# Altium schematic sheet Sunfish_ECU_Power_RevA.SchDoc
size A3; _PRJ_TITLE: PROJECT TITLE; _SHT_TITLE: Sheet; _REV: A; PageSetup: Record=PageOptions|CenterHorizontal=True|CenterVertical=True|PrintScale=0.71|XCorrection=1.00|YCorrection=1.00|PrintKind=0|BorderSize=5000000|LeftOffset=0|BottomOffset=0|Orientation=2|PaperLength=1000|PaperWidth=1000|Scale=100|PaperSource=258|PrintQuality=600|MediaType=1|DitherType=10|PaperKind=A3 (297x420mm)|PrintScaleMode=1
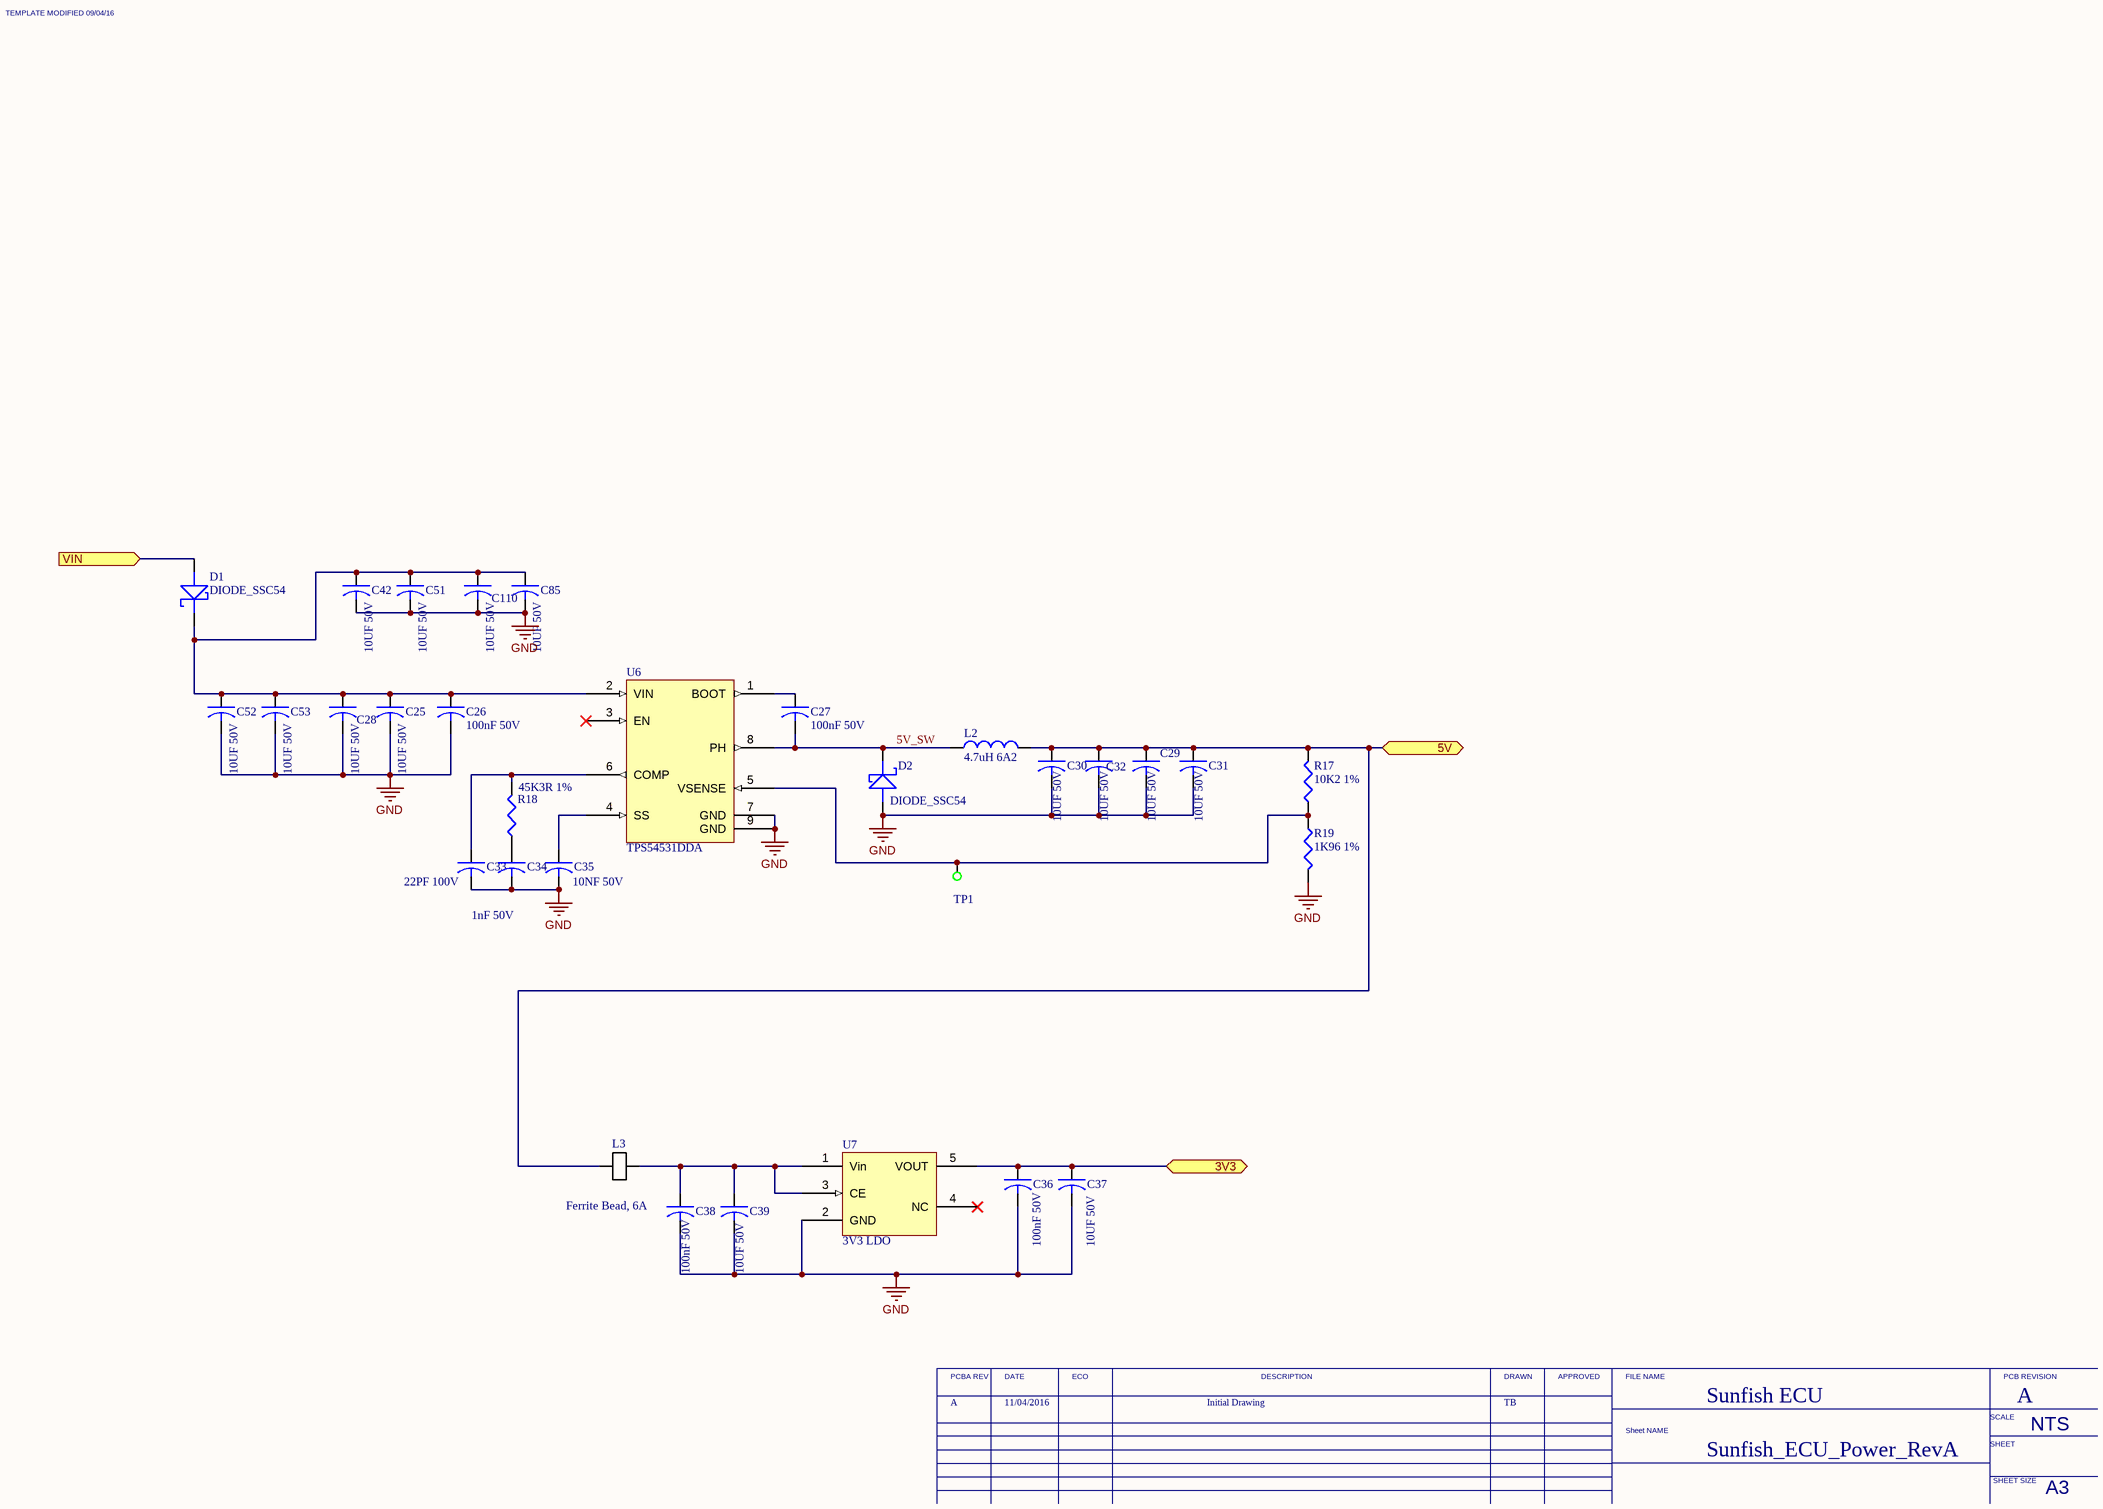
[diagram p0: Sunfish_ECU_Power_RevA.SchDoc]

## Parts
C25  10UF 50V  [1206]
C26  100nF 50V  [0603]
C27  100nF 50V  [0603]
C28  10UF 50V  [1206]
C29  10UF 50V  [1206]
C30  10UF 50V  [1206]
C31  10UF 50V  [1206]
C32  10UF 50V  [1206]
C33  22PF 100V  [0603]
C34  1nF 50V  [0603]
C35  10NF 50V  [0603]
C36  100nF 50V  [0603]
C37  10UF 50V  [1206]
C38  100nF 50V  [0603]
C39  10UF 50V  [1206]
C42  10UF 50V  [1206]
C51  10UF 50V  [1206]
C52  10UF 50V  [1206]
C53  10UF 50V  [1206]
C85  10UF 50V  [1206]
C110  10UF 50V  [1206]
D1  DIODE_SSC54  [DO-214AB]
D2  DIODE_SSC54  [DO-214AB]
L2  4.7uH 6A2  [Wurth744771156]
L3  Ferrite Bead, 6A  [1806]
R17  10K2 1%  [0603]
R18  45K3R 1%  [0603]
R19  1K96 1%  [0603]
TP1  Test Point  [TP_SMT]  (value not drawn)
U6  TPS54531DDA  [PSOP-8]
U7  3V3 LDO  [SOT-25-A]

## Ports
3V3 (bidir), 5V (bidir), VIN (in)

## Nets
GND: C25.2 C26.2 C28.2 C29.2 C30.2 C31.2 C32.2 C33.2 C34.2 C35.2 C36.2 C37.2 C38.2 C39.2 C42.2 C51.2 C52.2 C53.2 C85.2 C110.2 D2.A R19.2 U6.7(GND) U6.9(GND) U7.2(GND)
3V3: C36.1 C37.1 U7.5(VOUT) ; port 3V3
5V: C29.1 C30.1 C31.1 C32.1 L2.2 L3.1 R17.2 ; port 5V
5V_SW: C27.2 D2.K L2.1 U6.8(PH)
VIN: D1.A ; port VIN
NetC25_1: C25.1 C26.1 C28.1 C42.1 C51.1 C52.1 C53.1 C85.1 C110.1 D1.K U6.2(VIN)
NetC27_1: C27.1 U6.1(BOOT)
NetC33_1: C33.1 R18.2 U6.6(COMP)
NetC34_1: C34.1 R18.1
NetC35_1: C35.1 U6.4(SS)
NetC38_1: C38.1 C39.1 L3.2 U7.1(Vin) U7.3(CE)
NetR17_1: R17.1 R19.1 TP1.1 U6.5(VSENSE)

Not connected (* = marked no-connect by the designer): U6 3(EN)*; U7 4(NC)*

## Notes on the sheet
- A
- 11/04/2016
- Initial Drawing
- TB
- Sunfish ECU
- Sunfish_ECU_Power_RevA
- TEMPLATE MODIFIED 09/04/16
- PCBA REV
- DATE
- ECO
- DESCRIPTION
- DRAWN
- APPROVED
- FILE NAME
- PCB REVISION
- Sheet NAME
- SCALE
- SHEET
- NTS
- SHEET SIZE
- A3

## Library data of the parts
C25 C28-C32 C37 C39 C42 C51-C53 C85 C110 = CAP_10UF_50V_10%_1206: CAP CER 10UF 50V 10% X5R 1206; Manufacturer: Murata; Manufacturer P/N: GRM31CR61H106KA12L
C26 C27 C36 C38 = CAP_100NF_50V_10%_0603: CAP CER 100nF 50V 10% X7R 0603; Manufacturer: Murata; Manufacturer P/N: GRM188R71H104KA93D
C33 = CAP_22PF_100V_5%_0603: CAP CER 22PF 100V 5% NP0 0603; Manufacturer: Murata; Manufacturer P/N: GRM1885C2A220JA01D
C34 = CAP_1NF_50V_10%_0603: CAP CER 1nF 50V 10% X7R 0603; Manufacturer: Murata; Manufacturer P/N: GRM188R71H102KA01D
C35 = CAP_10NF_50V_10%_0603: CAP CER 10NF 50V 10% X7R 0603; Manufacturer: Murata; Manufacturer P/N: GRM188R71H103KA01D
D1 D2 = DIODE_SSC54: Schottky Diode, 5A, 40V SSC54, DO214AB; Manufacturer: Vishay; Manufacturer P/N: SSC54-E3/9AT
L2 = IND_4.7uH_6A2: FIXED IND 4.7UH 6.2A 34 MOHM; Manufacturer: Wurth Electronics Inc; Manufacturer P/N: 74437356047
L3 = IND_FERRITE_ BLM41PG600SN1L: Manufacturer: MURATA; Manufacturer P/N: BLM41PG600SN1L
R17 = RES_10K2_1%_0603: Resistor, 10K2, 1%, 0603; Manufacturer: Yageo; Manufacturer P/N: RC0603FR-0710K2L
R18 = RES_45K3_1%_0603: Resistor, 45K3, 1%, 0603; Manufacturer: Bourns Inc; Manufacturer P/N: CR0603-FX-4532ELF
R19 = RES_1K96_1%_0603: Resistor, 1K96, 1%, 0603; Manufacturer: Yageo; Manufacturer P/N: RC0603FR-071K96L
TP1 = MISC_TP_SMT: Probe compatible test point; Manufacturer: N/A; Manufacturer P/N: N/A
U6 = IC_SMPS_TPS54531: SMPS; Manufacturer: TI; Manufacturer P/N: TPS54531DDA
U7 = IC_XC6210B332MR-G: IC REG LDO 3.3V 0.7A SOT25; Manufacturer: Torex Semiconductor Ltd; Manufacturer P/N: XC6210B332MR-G